# EAGLE design TSAL (EAGLE 8.6.2)
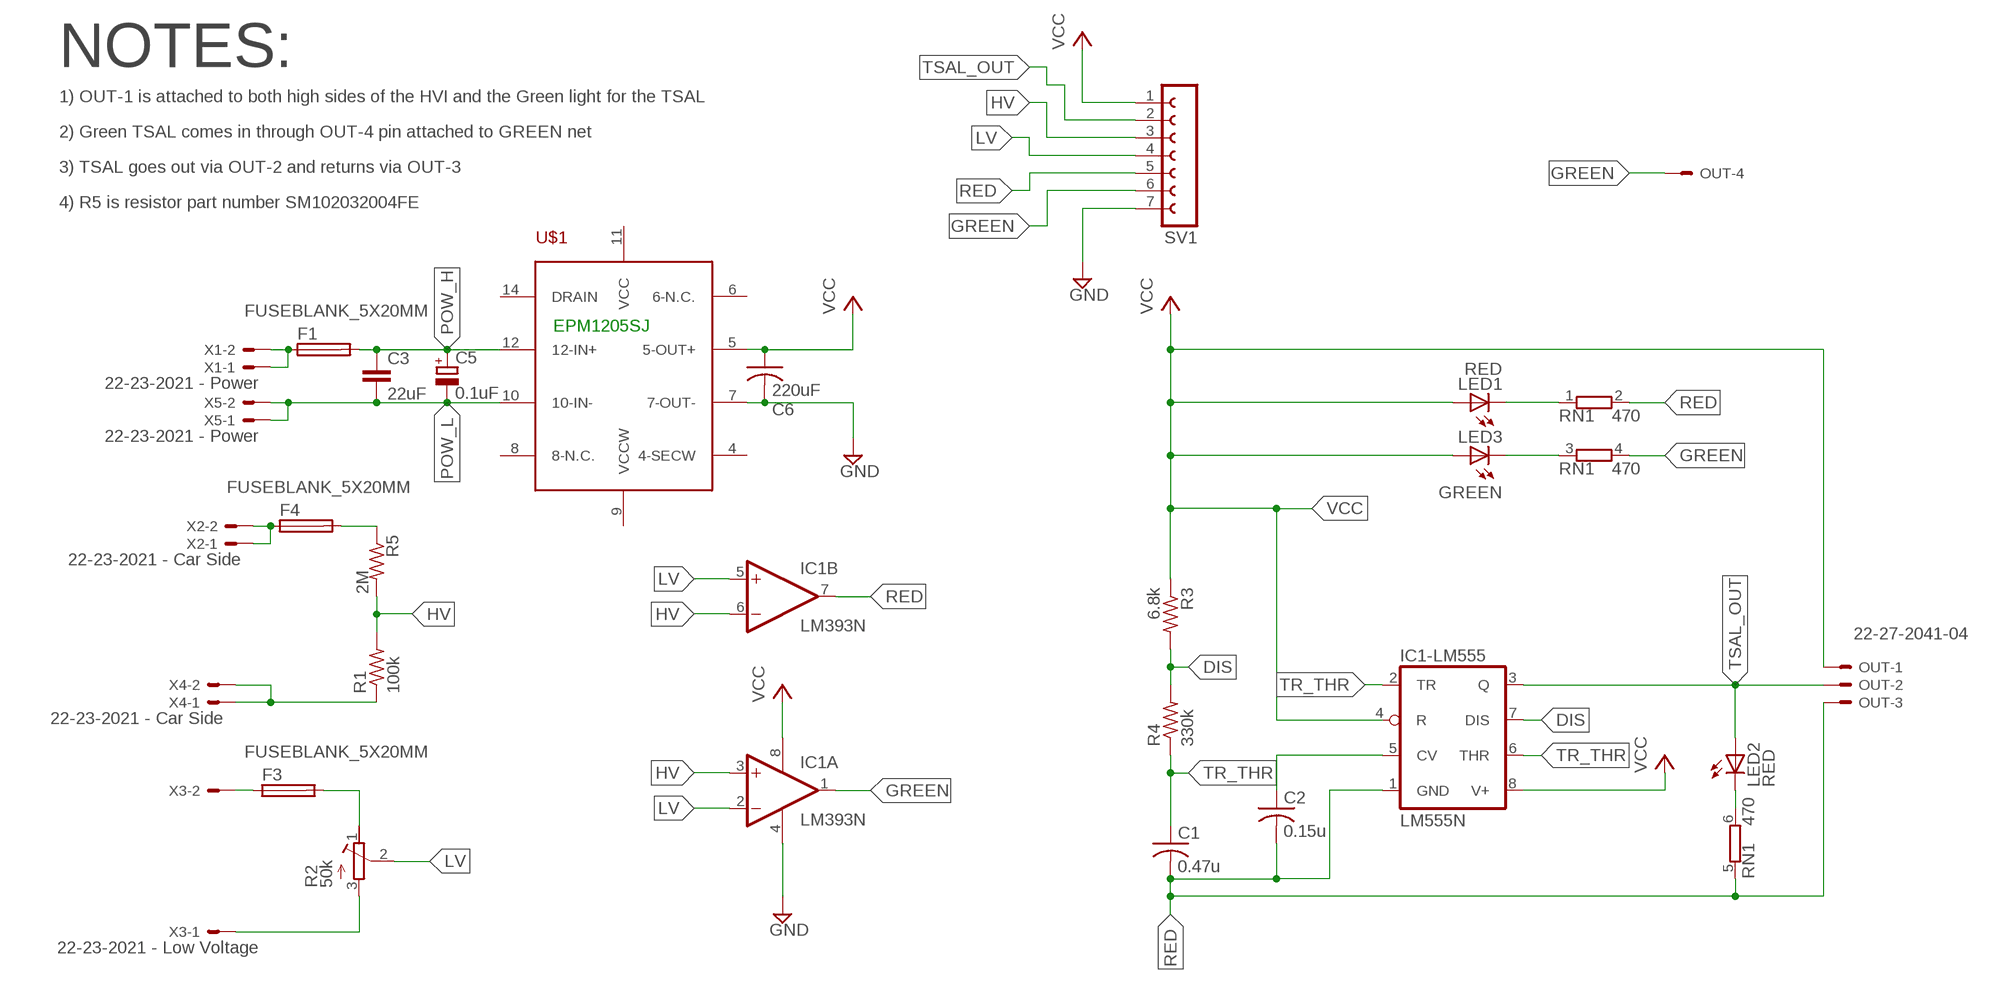
[diagram p0: schematic, sheet 1]

## Parts
C1  0.47u  C-US050-075X075  [C050-075X075]
C2  0.15u  C-US050-075X075  [C050-075X075]
C3  22uF  C-EU150-091X182  [C150-091X182]
C5  0.1uF  CPOL-EUE7.5-16  [E7,5-16]
C6  220uF  C-US050-055X075  [C050-055X075]
F1  FUSEBLANK_5X20MM  [FUSE_HOLDER_5X20MM]
F3  FUSEBLANK_5X20MM  [FUSE_HOLDER_5X20MM]
F4  FUSEBLANK_5X20MM  [FUSE_HOLDER_5X20MM]
IC1  LM393N  [DIL08]
IC1-LM555  LM555N  [DIL08]
LED1  RED  LED3MM  [LED3MM]
LED2  RED  LED3MM  [LED3MM]
LED3  GREEN  LED3MM  [LED3MM]
OUT  22-27-2041-04  [6410-04]
R1  100k  R-US_0207/10  [0207/10]
R2  50k  R-TRIMM3006P  [RTRIM3006P]
R3  6.8k  R-US_0309/12  [0309/12]
R4  330k  R-US_0309/12  [0309/12]
R5  2M  R-US_0207/10  [0207/10]
RN1  470  E3RP  [SIL6]
SV1  FE07W  [FE07W]
U$1  EPM1205SJ  [EPM1205SJ]
X1  22-23-2021 - Power  22-23-2021  [22-23-2021]
X2  22-23-2021 - Car Side  22-23-2021  [22-23-2021]
X3  22-23-2021 - Low Voltage  22-23-2021  [22-23-2021]
X4  22-23-2021 - Car Side  22-23-2021  [22-23-2021]
X5  22-23-2021 - Power  22-23-2021  [22-23-2021]

## Nets
DIS: IC1-LM555.7(DIS) R3.2 R4.2
GND: C6.2 IC1.4(P:V-) SV1.7 U$1.7(7-OUT-)
GREEN: IC1.1(A:OUT) OUT.4 RN1.4 SV1.6
HV [High Voltage]: IC1.3(A:+IN) IC1.6(B:-IN) R1.2 R5.2 SV1.3
LV: IC1.2(A:-IN) IC1.5(B:+IN) R2.2(S) SV1.4
N$2: R1.1 X4.1 X4.2
N$3: F3.2 R2.1(E)
N$4: R2.3(A) X3.1
N$5: F4.1 X2.1 X2.2
N$6: F3.1 X3.2
N$7: LED3.K(C) RN1.3
N$10 [High Voltage]: F1.1 X1.1 X1.2
N$11: F4.2 R5.1
N$14: C2.1 IC1-LM555.5(CV)
N$15: LED2.K(C) RN1.6
N$16: LED1.K(C) RN1.1
POW_H [High Voltage]: C3.1 C5.+ F1.2 U$1.12(12-IN+)
POW_L [High Voltage]: C3.2 C5.- U$1.10(10-IN-) X5.1 X5.2
RED: C1.2 C2.2 IC1-LM555.1(GND) IC1.7(B:OUT) OUT.3 RN1.2 RN1.5 SV1.5
TR_THR: C1.1 IC1-LM555.2(TR) IC1-LM555.6(THR) R4.1
TSAL_OUT: IC1-LM555.3(Q) LED2.A OUT.2 SV1.2
VCC: C6.1 IC1-LM555.4(R) IC1-LM555.8(V+) IC1.8(P:V+) LED1.A LED3.A OUT.1 R3.1 SV1.1 U$1.5(5-OUT+)
Unconnected: U$1.4(4-SECW) U$1.6(6-N.C.) U$1.8(8-N.C.) U$1.9(VCCW) U$1.11(VCC) U$1.14(DRAIN)

## Notes on the sheet
- NOTES:
- 1) OUT-1 is attached to both high sides of the HVI and the Green light for the TSAL
- 2) Green TSAL comes in through OUT-4 pin attached to GREEN net
- 3) TSAL goes out via OUT-2 and returns via OUT-3
- 4) R5 is resistor part number SM102032004FE
- EPM1205SJ

## Library data of the parts
C1 C2 C6 = rcl:C-US: CAPACITOR, American symbol; SPICEPREFIX: C
C3 = rcl:C-EU: CAPACITOR, European symbol; SPICEPREFIX: C
C5 = rcl:CPOL-EU: POLARIZED CAPACITOR, European symbol; SPICEPREFIX: C
F1 F3 F4 = fuse:FUSE: Fuse; OC_FARNELL: unknown; OC_NEWARK: unknown
IC1 = linear:LM393: COMPARATOR
IC1-LM555 = linear:*555: TIMER
LED1-LED3 = led:LED: LED OSRAM: - CHIPLED LG R971, LG N971, LY N971, LG Q971, LY Q971, LO R971, LY R971 LH N974, LH R974 LS Q976, LO Q976, LY Q976 LO Q996 - Hyper CHIPLED LW Q18S LB Q993, LB Q99A, LB R99A - SideLED LS A670, LO A670, LY A670, LG A670, LP A670 LB A673, LV A673, LT A673, LW A673 LH A674 LY A675 LS A676, LA A676, LO A676, LY A676, LW A676 LS A679, LY A679, LG A679 - Hyper Micro SIDELED® LS Y876, LA Y876, LO Y876, LY Y876 LT Y87S - SmartLED LW L88C, LW L88S LB L89C, LB L89S, LG L890 LS L89K, LO L89K, LY L89K LS L896, LA L896, LO L896, LY L896 - TOPLED LS T670, LO T670, LY T670, LG T670, LP T670 LSG T670, LSP T670, LSY T670, LOP T670, LYG T670 LG T671, LOG T671, LSG T671 LB T673, LV T673, LT T673, LW T673 LH T674 LS T676, LA T676, LO T676, LY T676, LB T676, LH T676, LSB T676, LW T676 LB T67C, LV T67C, LT T67C, LS T67K, LO T67K, LY T67K, LW E67C LS E67B, LA E67B, LO E67B, LY E67B, LB E67C, LV E67C, LT E67C LW T67C LS T679, LY T679, LG T679 LS T770, LO T770, LY T770, LG T770, LP T770 LB T773, LV T773, LT T773, LW T773 LH T774 LS E675, LA E675, LY E675, LS T675 LS T776, LA T776, LO T776, LY T776, LB T776 LHGB T686 LT T68C, LB T68C - Hyper Mini TOPLED® LB M676 - Mini TOPLED Santana® LG M470 LS M47K, LO M47K, LY M47K Source: http://www.osram.convergy.de LUXEON: - LUMILED® LXK2-PW12-R00, LXK2-PW12-S00, LXK2-PW14-U00, LXK2-PW14-V00 LXK2-PM12-R00, LXK2-PM12-S00, LXK2-PM14-U00 LXK2-PE12-Q00, LXK2-PE12-R00, LXK2-PE12-S00, LXK2-PE14-T00, LXK2-PE14-U00 LXK2-PB12-K00, LXK2-PB12-L00, LXK2-PB12-M00, LXK2-PB14-N00, LXK2-PB14-P00, LXK2-PB14-Q00 LXK2-PR12-L00, LXK2-PR12-M00, LXK2-PR14-Q00, LXK2-PR14-R00 LXK2-PD12-Q00, LXK2-PD12-R00, LXK2-PD12-S00 LXK2-PH12-R00, LXK2-PH12-S00 LXK2-PL12-P00, LXK2-PL12-Q00, LXK2-PL12-R00 Source: www.luxeon.com KINGBRIGHT: KA-3528ASYC Source: www.kingbright.com
OUT = con-molex:22-?-04: CONNECTOR wire to board 2.54 mm (.1 inch) pitch header; MF: MOLEX; OC_FARNELL: unknown; OC_NEWARK: unknown
R1 R3-R5 = resistor:R-US_: RESISTOR, American symbol
R2 = resistor:R-TRIMM: Trimm resistor
RN1 = resistor-sil:E3RP: SIL RESISTOR; OC_FARNELL: unknown; OC_NEWARK: unknown
SV1 = con-lsta:FE07W: FEMALE HEADER; OC_FARNELL: unknown; OC_NEWARK: unknown
U$1 = DC-DC Converter:EPM1205SJ
X1-X5 = con-molex:22-23-2021: .100" (2.54mm) Center Header - 2 Pin; MF: MOLEX; MPN: 22-23-2021; OC_FARNELL: 1462926; OC_NEWARK: 25C3832

## Net classes
0 default: width 0.508 mm, drill 0.254 mm, clearance 0.205 mm
1 High Voltage: width 0.762 mm, drill 0.163 mm, clearance 0.5 mm

## Board
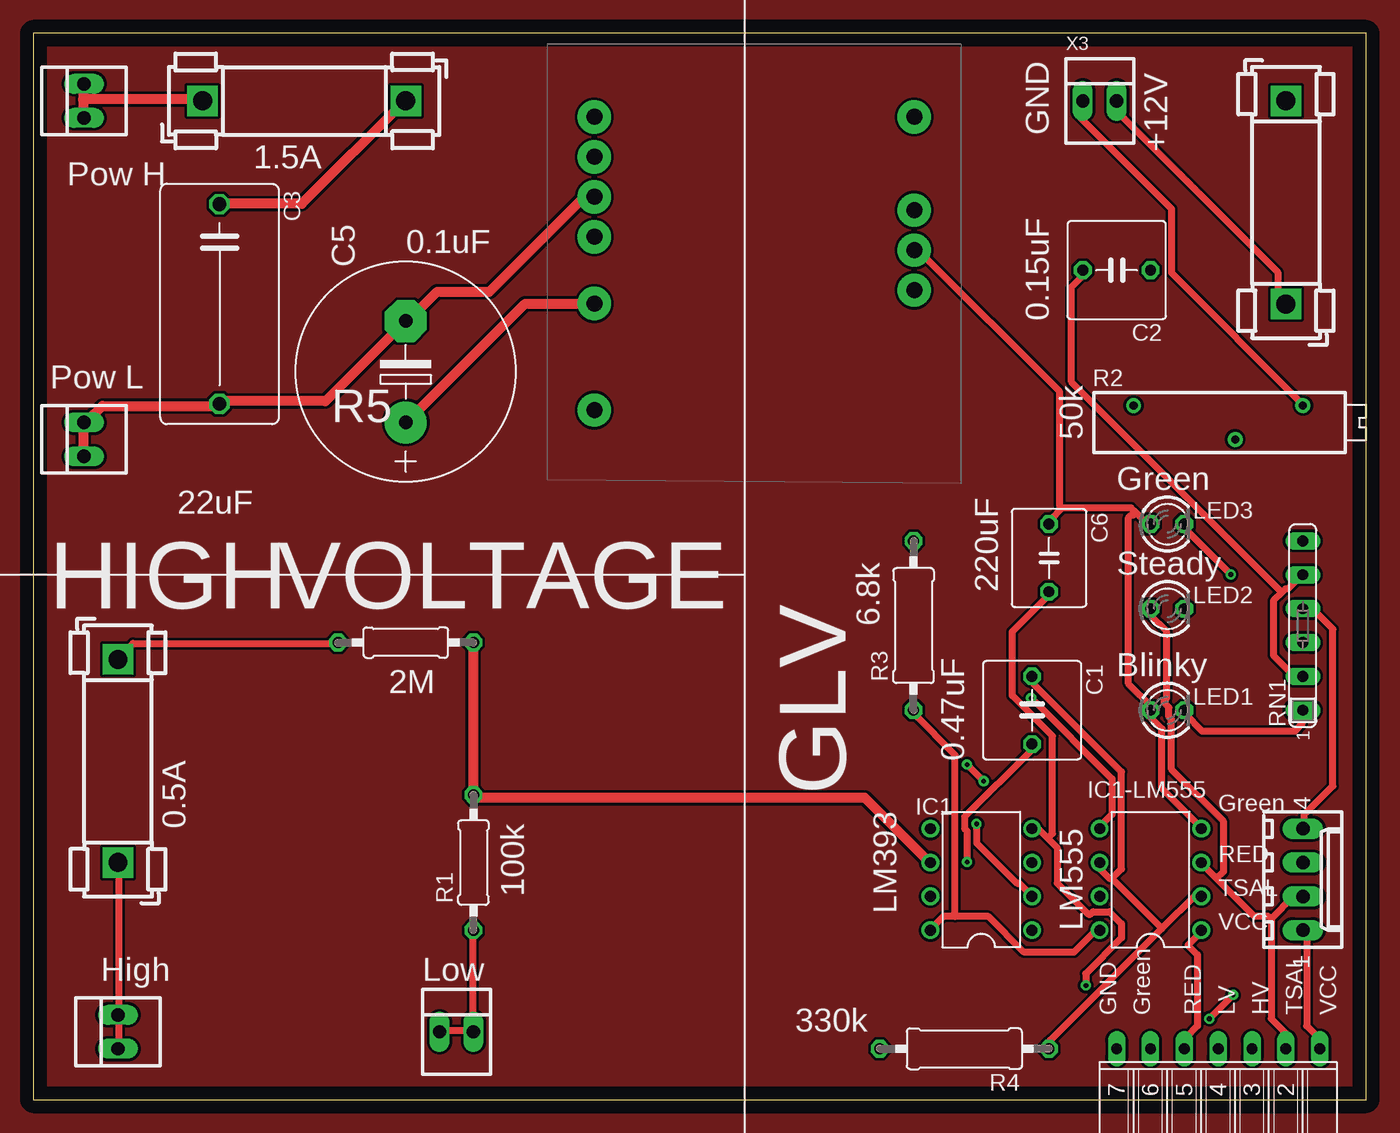
[diagram p1: board, top side]
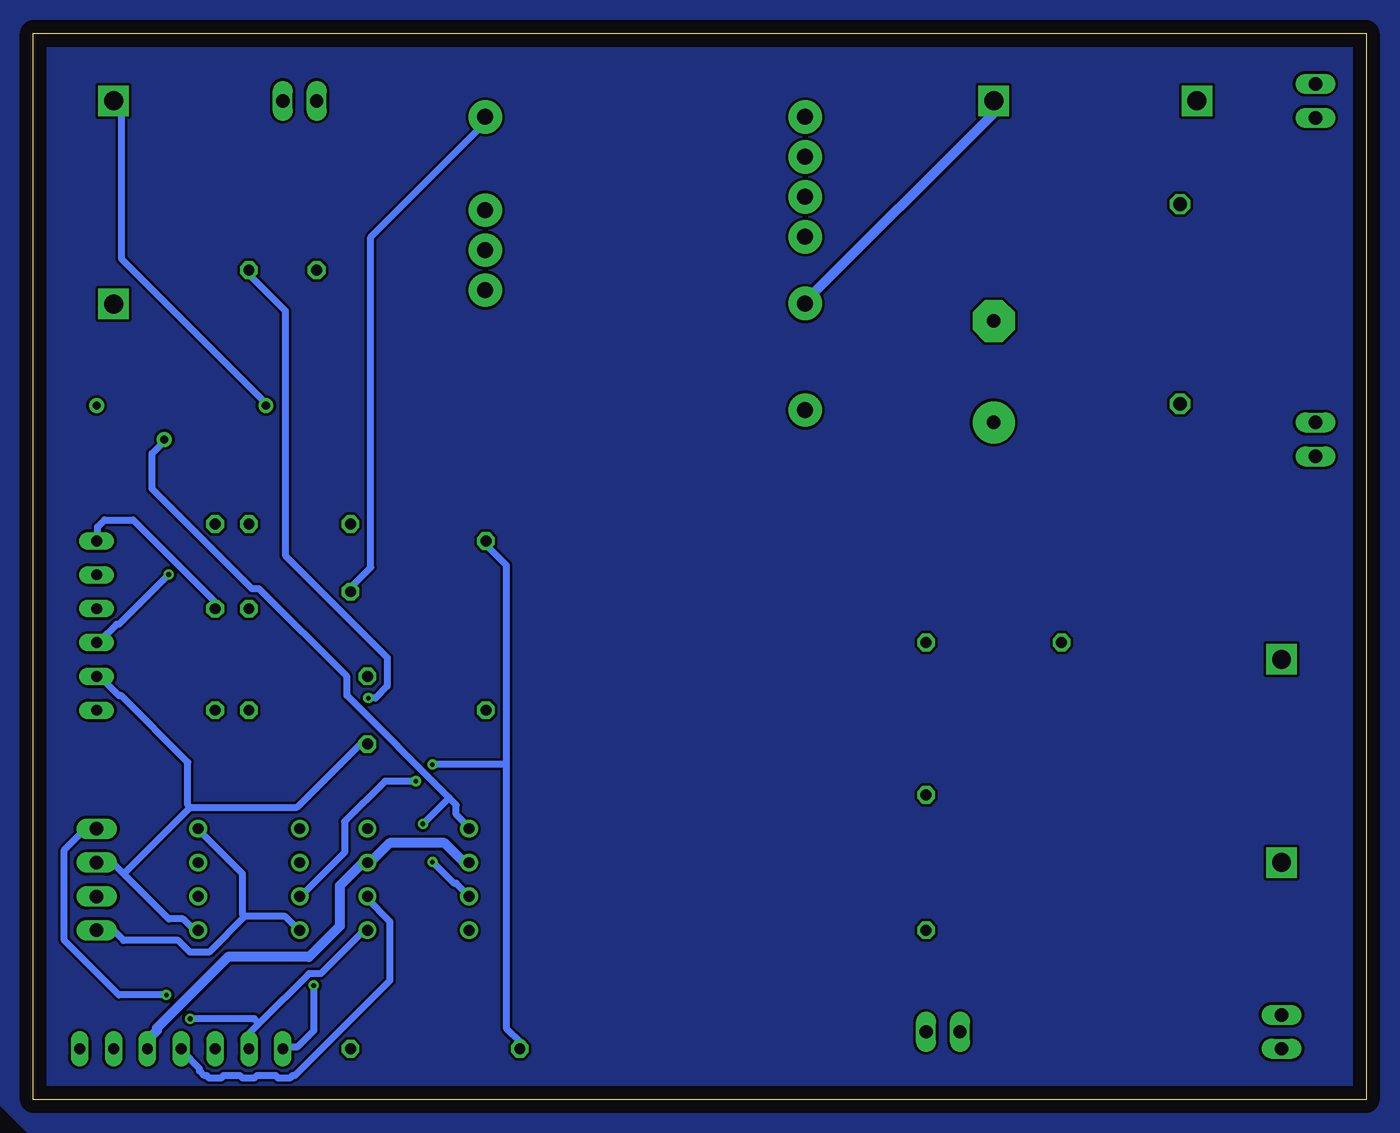
[diagram p2: board, bottom side, seen from below]

Size 100 x 80 mm. Coordinates in mm from the lower left corner, seen from the top.
Outline: 0,0 100,0 100,80 0,80 0,0
Copper layers (1*16): Top 0.035mm / dielectric 1.5mm / Bottom 0.035mm
Design rules "default": minimum track width 6mil, minimum drill 0.35mm, track to track 6mil, track to pad 6mil, pad to pad 6mil, via to via 6mil, smd to smd 6mil, copper to edge 40mil, drill to drill 6mil, minimum pad ring 10mil, minimum via ring 8mil, stop-mask expansion 4mil, vias tented up to drill 0mil, thermal gap 10mil

### Footprints (pad centres in the part's own frame; a part is rotated, then mirrored left to right if it is on the bottom)
C050-075X075 = drill 0.813 octagon: 1 -2.54,0; 2 2.54,0
C150-091X182 = drill 1.016 octagon: 1 -7.493,0; 2 7.493,0
E7,5-16 = drill 1.016 pad 3.15: + -3.81,0 | drill 1.016 pad 3.15 octagon: - 3.81,0
C050-055X075 = drill 0.813 octagon: 1 -2.54,0; 2 2.54,0
FUSE_HOLDER_5X20MM = drill 1.422 pad 2.286 square: 1 0,0; 2 15.24,0
DIL08 = drill 0.813 pad 1.27: 1 -3.81,-3.81; 2 -1.27,-3.81; 3 1.27,-3.81; 4 3.81,-3.81; 5 3.81,3.81; 6 1.27,3.81; 7 -1.27,3.81; 8 -3.81,3.81
LED3MM = drill 0.813 octagon: A -1.27,0; K 1.27,0
6410-04 = drill 1.016 long: 1 3.81,0; 2 1.27,0; 3 -1.27,0; 4 -3.81,0
0207/10 = drill 0.813 octagon: 1 -5.08,0; 2 5.08,0
RTRIM3006P = drill 0.61: 1 -7.62,1.27; 2 0,-1.27; 3 5.08,1.27
0309/12 = drill 0.813 octagon: 1 -6.35,0; 2 6.35,0
SIL6 = drill 0.813 long: 1 -6.35,0; 2 -3.81,0; 3 -1.27,0; 4 1.27,0; 5 3.81,0; 6 6.35,0
FE07W = drill 0.813 long: 1 -7.62,0; 2 -5.08,0; 3 -2.54,0; 4 0,0; 5 2.54,0; 6 5.08,0; 7 7.62,0
EPM1205SJ = drill 1.2 pad 2.5: 4 12.75,-1.5; 5 12.75,1.5; 6 12.75,4.5; 7 12.75,11.5; 8 -11.25,11.5; 9 -11.25,8.5; 10 -11.25,5.5; 11 -11.25,2.5; 12 -11.25,-2.5; 14 -11.25,-10.5
22-23-2021 = drill 1 long: 1 -1.27,0; 2 1.27,0

### Placement (x,y rotation side)
C1  74.93,29.21 270 top
C2  81.28,62.23 180 top
C3  13.97,59.69 270 top
C5  27.94,54.61 90 top
C6  76.2,40.64 270 top
F1  12.7,74.93 0 top
F3  93.98,59.69 90 top
F4  6.35,17.78 90 top
IC1  71.12,16.51 90 top
IC1-LM555  83.82,16.51 90 top
LED1  85.09,29.21 0 top
LED2  85.09,36.83 0 top
LED3  85.09,43.18 0 top
OUT  95.25,16.51 270 top
R1  33.02,17.78 90 top
R2  90.17,50.8 0 top
R3  66.04,35.56 90 top
R4  69.85,3.81 180 top
R5  27.94,34.29 0 top
RN1  95.25,35.56 90 top
SV1  88.9,3.81 180 top
U$1  53.34,62.23 0 top
X1  3.81,74.93 90 top
X2  6.35,5.08 90 top
X3  80.01,74.93 0 top
X4  31.75,5.08 0 top
X5  3.81,49.53 90 top

### Tracks (layer width: path | path; a pad name or v marks a point on that pad's centre or on a via)
DIS  (via drill 0.35)
  Top 0.508: v70.05,25.13 v71.3,23.89
  Bottom 0.508: 64.53,25.13 64.53,40.11 65.95,41.53 65.95,41.89 R3.2 | 64.53,25.13 64.53,5.35 63.46,4.28 63.46,3.92 R4.2 | v71.3,23.89 73.62,23.89 76.65,20.86 76.65,18.54 79.86,15.33 IC1-LM555.7 | 64.53,25.13 v70.05,25.13
GND  (via drill 0.35)
  Top 0.508: v78.97,8.56 78.97,9.45 81.64,12.12 81.64,13.19 80.75,14.08 79.5,14.08 79.32,13.9 79.14,13.9 76.83,16.22 76.83,18.89 76.11,19.61 | 76.11,19.61 75.4,20.32 75.04,20.32 IC1.4 | C6.2 76.11,37.97 76.11,37.79 73.44,35.12 73.44,30.3 76.47,27.27 76.47,19.96 76.11,19.61
  Bottom 0.508: v78.97,8.56 78.97,5.17 80.21,3.92 81.1,3.92 SV1.7 | U$1.7 66.13,73.62 66.13,73.26 74.69,64.7 74.69,39.93 76.11,38.5 76.11,38.15 C6.2
GREEN  (via drill 0.35)
  Top 0.508: RN1.4 95.36,36.72 96.08,36.72 97.5,35.29 97.5,23.53 95.36,21.39 95.36,20.32 OUT.4 | v88.23,6.06 v90.02,7.84
  Bottom 0.508: 83.06,5.7 79.32,9.45 78.43,9.45 75.04,12.83 IC1.1 | 83.06,5.7 83.78,4.99 83.78,3.92 SV1.6 | v90.02,7.84 93.58,7.84 97.68,11.94 97.68,18.72 96.25,20.14 95.36,20.14 OUT.4 | v88.23,6.06 83.42,6.06 83.06,5.7
HV
  Top 0.762: R5.2 32.98,34.22 32.98,22.99 R1.2 33.33,22.64 62.39,22.64 67.2,17.82 IC1.6
  Bottom 0.762: IC1.6 67.38,17.82 67.73,17.82 69.16,19.25 73.26,19.25 74.69,17.82 74.86,17.82 IC1.3 75.22,17.82 77,16.04 77,13.01 79.32,10.7 85.38,10.7 90.73,5.35 90.73,5.17 91.26,4.63 91.26,3.92 SV1.3
LV  (via drill 0.35)
  Top 0.508: v70.77,20.68 70.77,19.25 73.8,16.22 73.97,16.22 74.86,15.33 IC1.2
  Bottom 0.508: 68.81,22.64 68.27,22.1 68.27,21.39 67.2,20.32 IC1.5 | 68.81,22.64 76.47,30.3 76.47,31.73 83.06,38.32 83.6,38.32 91.09,45.81 91.09,48.48 90.19,49.38 R2.2 | 68.81,22.64 v70.77,20.68 | SV1.4 88.77,3.74 88.77,3.56 87.52,2.32 87.52,2.14 87.16,1.78 86.99,1.78 86.81,1.6 85.92,1.6 85.74,1.78 84.49,1.78 84.31,1.6 83.42,1.6 83.24,1.78 81.82,1.78 81.64,1.6 80.75,1.6 80.57,1.78 80.39,1.78 73.26,8.91 73.26,13.37 75.04,15.15 IC1.2
N$2
  Top 0.508: R1.1 32.98,12.66 32.98,5.17 X4.2 32.8,5.17 30.48,5.17 X4.1
N$3
  Bottom 0.508: R2.1 82.71,52.23 82.71,52.41 93.4,63.1 93.4,74.33 93.94,74.86 F3.2
N$4
  Top 0.508: R2.3 95.19,52.23 85.38,62.03 85.38,66.84 78.61,73.62 78.61,74.86 78.79,75.04 X3.1
N$5
  Top 0.508: X2.1 6.42,3.92 6.42,6.24 X2.2 6.42,6.42 6.42,17.65 F4.1
N$6
  Top 0.508: X3.2 81.28,74.86 81.28,74.15 93.4,62.03 93.4,60.25 93.94,59.71 F3.1
N$7  (via drill 0.35)
  Top 0.508: v89.84,39.39 86.45,42.78 86.45,43.14 LED3.K
  Bottom 0.508: v89.84,39.39 93.58,35.65 93.76,35.65 95.01,34.4 95.19,34.4 RN1.3
N$8
  pour Top: -5.08,87.63 -5.08,-2.54 102.87,-2.54 104.14,-1.27 106.68,1.27 106.68,86.36 -2.54,86.36 -3.81,87.63
N$9
  pour Bottom: -5.08,86.36 106.68,86.36 106.68,3.81 100.33,-2.54 -2.54,-2.54 -5.08,0
N$10
  Top 0.762: 3.74,75.04 3.74,76.11 X1.2 | 3.74,75.04 3.74,73.8 X1.1 | 3.74,75.04 12.66,75.04 F1.1
N$11
  Top 0.508: R5.1 22.82,34.22 7.49,34.22 6.42,33.15 F4.2
N$14  (via drill 0.35)
  Top 0.508: v74.86,30.12 80.92,24.06 80.92,21.39 80.03,20.5 80.03,20.32 IC1-LM555.5
  Bottom 0.508: v74.86,30.12 74.33,30.12 73.44,31.02 73.44,33.15 81.1,40.82 81.1,59.18 83.78,61.85 83.78,62.21 C2.1
N$15
  Bottom 0.508: LED2.K 86.45,36.9 86.45,37.43 92.51,43.49 94.65,43.49 95.19,42.96 95.19,42.07 RN1.6
N$16
  Top 0.508: LED1.K 86.45,29.05 86.45,28.88 87.7,27.63 94.65,27.63 95.19,28.16 95.19,29.05 RN1.1
POW_H
  Top 0.762: C3.1 14.08,67.2 20.14,67.2 27.81,74.86 F1.2 | U$1.12 42.07,59.71 36.9,59.71 27.98,50.8 C5.+
  Bottom 0.762: F1.2 27.98,74.86 27.98,73.97 42.07,59.89 U$1.12
POW_L
  Top 0.762: U$1.10 42.07,67.56 41.18,67.56 34.22,60.6 30.3,60.6 27.98,58.29 C5.- 27.63,58.11 21.93,52.41 14.26,52.41 C3.2 13.9,52.05 5.17,52.05 4.1,50.98 X5.2 3.74,50.62 3.74,48.31 X5.1
RED  (via drill 0.35)
  Top 0.508: 93.67,38.06 93.94,38.32 94.12,38.32 95.19,39.39 RN1.5 | 93.67,38.06 93.05,37.43 93.05,33.33 94.47,31.91 95.19,31.91 RN1.2 | 93.67,38.06 77.89,53.83 77.89,60.96 78.61,61.67 78.61,62.21 C2.2 | v70.05,17.82 70.05,20.14 69.87,20.32 69.87,21.21 74.86,26.2 74.86,26.56 C1.2 | SV1.5 86.45,3.92 86.45,4.63 87.34,5.53 87.34,10.87 86.63,11.59 87.7,12.66 IC1-LM555.1
  Bottom 0.508: v70.05,17.82 68.45,16.22 68.27,16.22 67.38,15.33 IC1.7 | 93.22,16.93 89.84,13.55 88.77,13.55 88.06,12.83 87.7,12.83 IC1-LM555.1 | 93.22,16.93 93.94,17.65 95.19,17.65 OUT.3 | 88.23,21.93 80.21,21.93 75.4,26.74 75.04,26.74 C1.2 | 93.22,16.93 88.23,21.93 | RN1.2 95.19,31.73 94.83,31.37 94.65,31.37 93.58,30.3 93.4,30.3 88.41,25.31 88.41,22.1 88.23,21.93
TR_THR
  Top 0.508: 84.67,12.83 87.16,15.33 87.52,15.33 IC1-LM555.2 | 84.67,12.83 76.29,4.46 76.29,3.92 R4.1 | 80.92,16.58 80.75,16.58 80.03,17.29 80.03,17.65 IC1-LM555.6 | 84.67,12.83 80.92,16.58 | 80.92,16.58 81.64,17.29 81.64,24.6 75.04,31.19 75.04,31.73 C1.1
TSAL_OUT
  Top 0.508: 92.87,13.55 92.87,6.06 93.94,4.99 93.94,3.92 SV1.2 | 92.87,13.55 94.47,15.15 95.19,15.15 OUT.2 | 88.77,16.58 91.62,13.72 92.69,13.72 92.87,13.55 | 88.77,16.58 87.7,17.65 IC1-LM555.3 | 88.77,16.58 89.3,17.11 89.3,20.86 85.38,24.78 85.38,28.52 85.2,28.7 85.2,29.41 84.85,29.77 84.85,29.95 85.03,30.12 85.03,35.12 83.78,36.36 83.78,36.72 LED2.A
VCC
  Top 0.508: 77.18,44.38 76.29,43.49 76.29,43.31 C6.1 | 77.18,44.38 82.35,44.38 82.71,44.03 | 82.71,44.03 83.42,43.31 83.78,43.31 LED3.A | U$1.5 66.13,63.63 66.49,63.63 77,53.12 77,44.56 77.18,44.38 | IC1-LM555.4 87.7,20.32 84.67,23.35 84.67,27.81 83.78,28.7 83.78,29.05 LED1.A 83.96,29.41 82.17,31.19 82.17,43.67 82.35,43.85 82.53,43.85 82.71,44.03 | SV1.1 96.43,3.92 96.43,4.63 95.54,5.53 95.54,12.48 95.36,12.66 OUT.1 | 69.16,13.72 71.66,13.72 74.33,11.05 78.07,11.05 79.86,12.83 IC1-LM555.8 | 69.16,13.72 68.27,13.72 67.38,12.83 IC1.8 | 69.16,13.72 69.16,25.85 66.13,28.88 66.13,29.05 R3.1
  Bottom 0.508: 84.13,13.72 86.81,11.05 88.23,11.05 89.12,11.94 93.22,11.94 93.94,12.66 95.19,12.66 OUT.1 | 84.13,13.72 81.1,13.72 80.03,12.66 IC1-LM555.8 | IC1-LM555.4 87.52,20.14 84.31,16.93 84.31,13.9 84.13,13.72

### Text on the board
tNames: GND | +12V | 1.5A | Pow H | 0.1uF | 0.15uF | Pow L | 50k | 22uF | Green | HIGH | VOLTAGE | Steady | 220uF | 6.8k | Blinky | 2M | 0.47uF | GLV | Green | 0.5A | RED | 100k | TSAL | LM393 | LM555 | VCC | High | Low | GND | Green | RED | LV | HV | TSAL | VCC | 330k